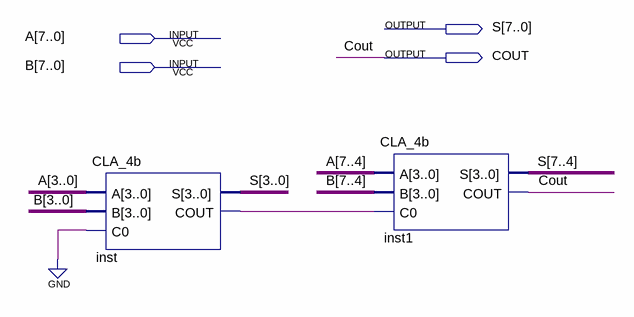
[diagram p0: schematic sheet]
// Quartus schematic CLA_8b.bdf as structural Verilog: 2 symbols, 4 pins
module CLA_8b (
  input  [7:0] A,
  input  [7:0] B,
  output [7:0] S,
  output COUT
);

  wire inst_cout;

  CLA_4b inst (.A(A[3:0]), .B(B[3:0]), .C0(1'b0), .S(S[3:0]), .COUT(inst_cout));
  CLA_4b inst1 (.A(A[7:4]), .B(B[7:4]), .C0(inst_cout), .S(S[7:4]), .COUT(COUT));
endmodule
